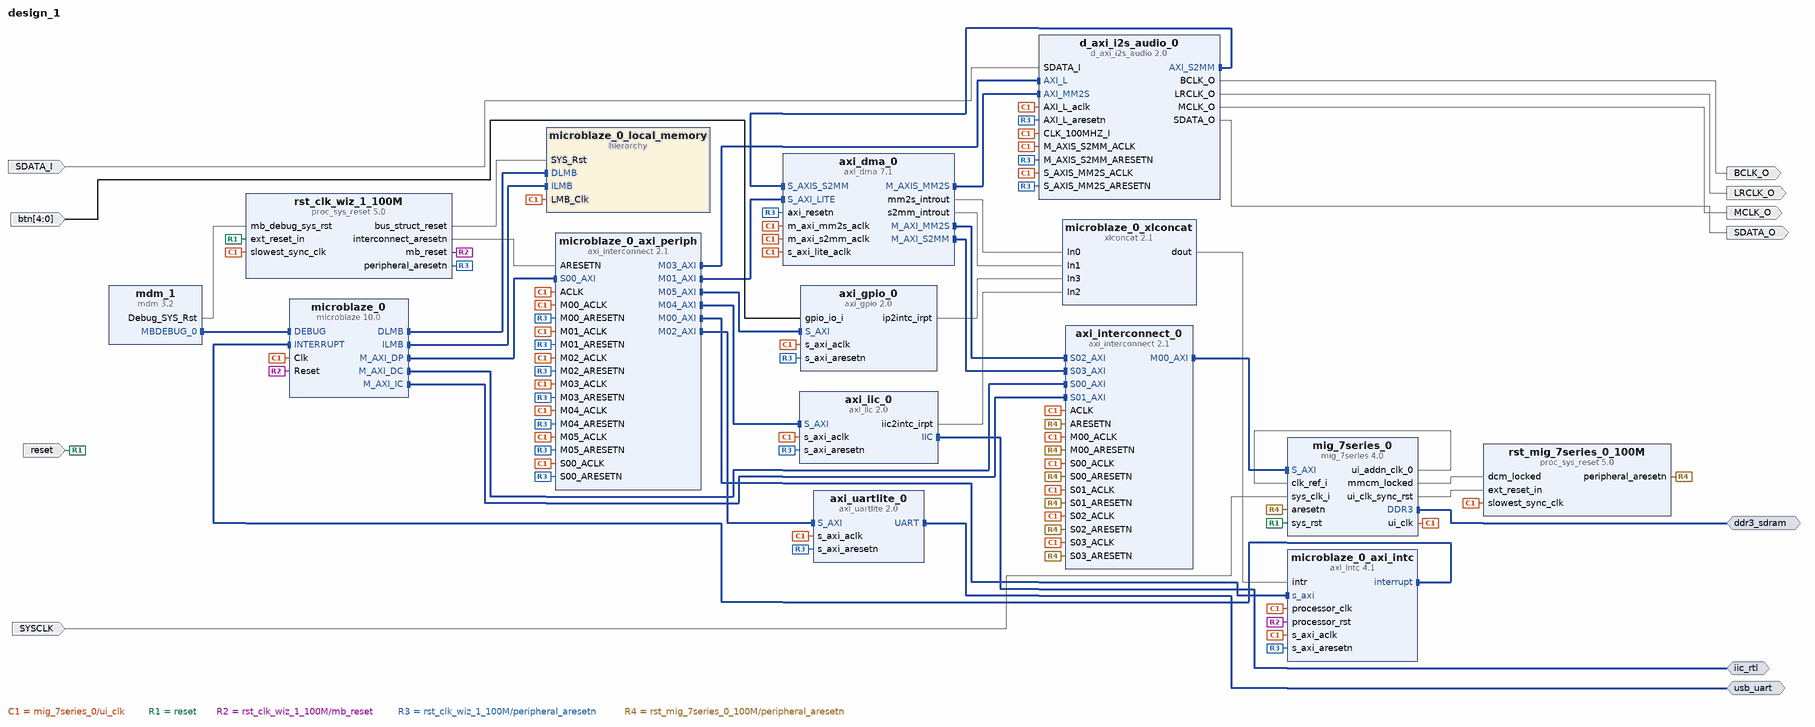
[diagram p0: block diagram of the top level]
# Vivado block design design_1, xc7a200tsbg484-1, Vivado 2016.4
create_bd_design design_1

create_bd_intf_port -mode Master -vlnv xilinx.com:interface:ddrx_rtl:1.0 ddr3_sdram
create_bd_intf_port -mode Master -vlnv xilinx.com:interface:iic_rtl:1.0 iic_rtl
create_bd_intf_port -mode Master -vlnv xilinx.com:interface:uart_rtl:1.0 usb_uart
create_bd_port -dir I SDATA_I
create_bd_port -dir I SYSCLK
create_bd_port -dir I -from 4 -to 0 btn
create_bd_port -dir O BCLK_O
create_bd_port -dir O LRCLK_O
create_bd_port -dir O MCLK_O
create_bd_port -dir O SDATA_O
create_bd_port -dir I -type rst reset
set_property -dict {CONFIG.POLARITY ACTIVE_LOW} [get_bd_ports reset]

create_bd_cell -type hier microblaze_0_local_memory
create_bd_cell -type ip -vlnv xilinx.com:ip:xlconcat:2.1 microblaze_0_xlconcat
set_property -dict {CONFIG.NUM_PORTS 4} [get_bd_cells microblaze_0_xlconcat]
create_bd_cell -type ip -vlnv xilinx.com:ip:axi_dma:7.1 axi_dma_0
set_property -dict [list \
  CONFIG.c_include_sg 0 \
  CONFIG.c_sg_length_width 23 \
  CONFIG.c_include_mm2s_dre 0 \
  CONFIG.c_mm2s_burst_size 256 \
  CONFIG.c_include_s2mm_dre 0 \
  CONFIG.c_s2mm_burst_size 256 \
] [get_bd_cells axi_dma_0]
create_bd_cell -type ip -vlnv xilinx.com:ip:axi_gpio:2.0 axi_gpio_0
set_property -dict [list \
  CONFIG.C_GPIO_WIDTH 5 \
  CONFIG.C_ALL_INPUTS 1 \
  CONFIG.C_INTERRUPT_PRESENT 1 \
  CONFIG.USE_BOARD_FLOW true \
  CONFIG.GPIO_BOARD_INTERFACE Custom \
] [get_bd_cells axi_gpio_0]
create_bd_cell -type ip -vlnv xilinx.com:ip:axi_iic:2.0 axi_iic_0
create_bd_cell -type ip -vlnv xilinx.com:ip:axi_interconnect:2.1 axi_interconnect_0
set_property -dict [list \
  CONFIG.NUM_SI 4 \
  CONFIG.NUM_MI 1 \
  CONFIG.S02_HAS_DATA_FIFO 0 \
  CONFIG.S03_HAS_DATA_FIFO 0 \
] [get_bd_cells axi_interconnect_0]
create_bd_cell -type ip -vlnv xilinx.com:ip:axi_uartlite:2.0 axi_uartlite_0
set_property -dict [list \
  CONFIG.C_BAUDRATE 115200 \
  CONFIG.USE_BOARD_FLOW true \
  CONFIG.UARTLITE_BOARD_INTERFACE usb_uart \
] [get_bd_cells axi_uartlite_0]
create_bd_cell -type ip -vlnv digilentinc.com:user:d_axi_i2s_audio:2.0 d_axi_i2s_audio_0
set_property -dict {CONFIG.ENABLE_STREAM true} [get_bd_cells d_axi_i2s_audio_0]
create_bd_cell -type ip -vlnv xilinx.com:ip:mdm:3.2 mdm_1
create_bd_cell -type ip -vlnv xilinx.com:ip:microblaze:10.0 microblaze_0
set_property -dict [list \
  CONFIG.C_D_AXI 1 \
  CONFIG.C_D_LMB 1 \
  CONFIG.C_I_AXI 0 \
  CONFIG.C_I_LMB 1 \
  CONFIG.C_TRACE 0 \
  CONFIG.C_ENABLE_DISCRETE_PORTS 0 \
  CONFIG.G_TEMPLATE_LIST 6 \
  CONFIG.G_USE_EXCEPTIONS 1 \
  CONFIG.C_USE_MSR_INSTR 1 \
  CONFIG.C_USE_PCMP_INSTR 1 \
  CONFIG.C_USE_BARREL 0 \
  CONFIG.C_USE_DIV 1 \
  CONFIG.C_USE_HW_MUL 1 \
  CONFIG.C_USE_FPU 1 \
  CONFIG.C_M_AXI_D_BUS_EXCEPTION 1 \
  CONFIG.C_DEBUG_ENABLED 1 \
  CONFIG.C_NUMBER_OF_PC_BRK 2 \
  CONFIG.C_USE_ICACHE 1 \
  CONFIG.C_ICACHE_LINE_LEN 8 \
  CONFIG.C_USE_DCACHE 1 \
  CONFIG.C_DCACHE_LINE_LEN 8 \
  CONFIG.C_USE_MMU 0 \
] [get_bd_cells microblaze_0]
create_bd_cell -type ip -vlnv xilinx.com:ip:axi_intc:4.1 microblaze_0_axi_intc
set_property -dict {CONFIG.C_HAS_FAST 1} [get_bd_cells microblaze_0_axi_intc]
create_bd_cell -type ip -vlnv xilinx.com:ip:axi_interconnect:2.1 microblaze_0_axi_periph
set_property -dict {CONFIG.NUM_SI 1 CONFIG.NUM_MI 6} [get_bd_cells microblaze_0_axi_periph]
create_bd_cell -type ip -vlnv xilinx.com:ip:mig_7series:4.0 mig_7series_0
set_property -dict [list \
  CONFIG.XML_INPUT_FILE mig_a.prj \
  CONFIG.RESET_BOARD_INTERFACE reset \
  CONFIG.MIG_DONT_TOUCH_PARAM Custom \
  CONFIG.BOARD_MIG_PARAM ddr3_sdram \
] [get_bd_cells mig_7series_0]
create_bd_cell -type ip -vlnv xilinx.com:ip:proc_sys_reset:5.0 rst_clk_wiz_1_100M
set_property -dict {CONFIG.USE_BOARD_FLOW true CONFIG.RESET_BOARD_INTERFACE reset} [get_bd_cells rst_clk_wiz_1_100M]
create_bd_cell -type ip -vlnv xilinx.com:ip:proc_sys_reset:5.0 rst_mig_7series_0_100M

# ---- hierarchy /microblaze_0_local_memory ----
current_bd_instance /microblaze_0_local_memory
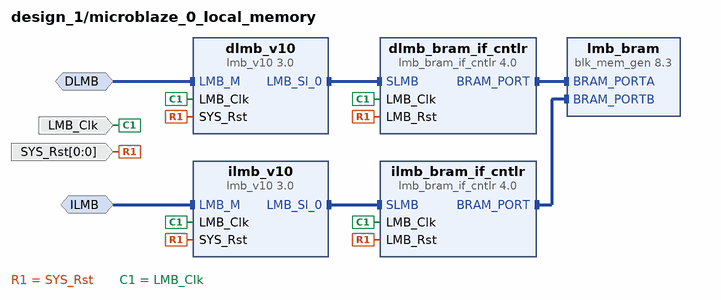
[diagram p1: block diagram inside /microblaze_0_local_memory]
create_bd_intf_pin -mode MirroredMaster -vlnv xilinx.com:interface:lmb_rtl:1.0 DLMB
create_bd_intf_pin -mode MirroredMaster -vlnv xilinx.com:interface:lmb_rtl:1.0 ILMB
create_bd_pin -dir I -type clk LMB_Clk
create_bd_pin -dir I -from 0 -to 0 -type rst SYS_Rst

create_bd_cell -type ip -vlnv xilinx.com:ip:lmb_bram_if_cntlr:4.0 dlmb_bram_if_cntlr
set_property -dict {CONFIG.C_ECC 0} [get_bd_cells dlmb_bram_if_cntlr]
create_bd_cell -type ip -vlnv xilinx.com:ip:lmb_v10:3.0 dlmb_v10
create_bd_cell -type ip -vlnv xilinx.com:ip:lmb_bram_if_cntlr:4.0 ilmb_bram_if_cntlr
set_property -dict {CONFIG.C_ECC 0} [get_bd_cells ilmb_bram_if_cntlr]
create_bd_cell -type ip -vlnv xilinx.com:ip:lmb_v10:3.0 ilmb_v10
create_bd_cell -type ip -vlnv xilinx.com:ip:blk_mem_gen:8.3 lmb_bram
set_property -dict {CONFIG.Memory_Type True_Dual_Port_RAM CONFIG.use_bram_block BRAM_Controller} [get_bd_cells lmb_bram]

# ---- connections ----

current_bd_instance /microblaze_0_local_memory
connect_bd_intf_net -intf_net microblaze_0_dlmb_bus [get_bd_intf_pins dlmb_bram_if_cntlr/SLMB] [get_bd_intf_pins dlmb_v10/LMB_Sl_0]
connect_bd_intf_net -intf_net microblaze_0_dlmb_cntlr [get_bd_intf_pins dlmb_bram_if_cntlr/BRAM_PORT] [get_bd_intf_pins lmb_bram/BRAM_PORTA]
connect_bd_intf_net -intf_net microblaze_0_ilmb_bus [get_bd_intf_pins ilmb_bram_if_cntlr/SLMB] [get_bd_intf_pins ilmb_v10/LMB_Sl_0]
connect_bd_intf_net -intf_net microblaze_0_ilmb_cntlr [get_bd_intf_pins ilmb_bram_if_cntlr/BRAM_PORT] [get_bd_intf_pins lmb_bram/BRAM_PORTB]
connect_bd_intf_net -intf_net microblaze_0_dlmb [get_bd_intf_pins DLMB] [get_bd_intf_pins dlmb_v10/LMB_M]
connect_bd_intf_net -intf_net microblaze_0_ilmb [get_bd_intf_pins ILMB] [get_bd_intf_pins ilmb_v10/LMB_M]
connect_bd_net [get_bd_pins SYS_Rst] \
  [get_bd_pins dlmb_bram_if_cntlr/LMB_Rst] [get_bd_pins dlmb_v10/SYS_Rst] [get_bd_pins ilmb_bram_if_cntlr/LMB_Rst] \
  [get_bd_pins ilmb_v10/SYS_Rst]
connect_bd_net -net microblaze_0_Clk [get_bd_pins LMB_Clk] \
  [get_bd_pins dlmb_bram_if_cntlr/LMB_Clk] [get_bd_pins dlmb_v10/LMB_Clk] [get_bd_pins ilmb_bram_if_cntlr/LMB_Clk] \
  [get_bd_pins ilmb_v10/LMB_Clk]

current_bd_instance /
connect_bd_intf_net [get_bd_intf_pins axi_dma_0/M_AXIS_MM2S] [get_bd_intf_pins d_axi_i2s_audio_0/AXI_MM2S]
connect_bd_intf_net [get_bd_intf_pins axi_dma_0/M_AXI_MM2S] [get_bd_intf_pins axi_interconnect_0/S02_AXI]
connect_bd_intf_net [get_bd_intf_pins axi_dma_0/M_AXI_S2MM] [get_bd_intf_pins axi_interconnect_0/S03_AXI]
connect_bd_intf_net [get_bd_intf_pins axi_interconnect_0/M00_AXI] [get_bd_intf_pins mig_7series_0/S_AXI]
connect_bd_intf_net [get_bd_intf_pins axi_dma_0/S_AXIS_S2MM] [get_bd_intf_pins d_axi_i2s_audio_0/AXI_S2MM]
connect_bd_intf_net [get_bd_intf_pins axi_interconnect_0/S00_AXI] [get_bd_intf_pins microblaze_0/M_AXI_DC]
connect_bd_intf_net [get_bd_intf_pins axi_interconnect_0/S01_AXI] [get_bd_intf_pins microblaze_0/M_AXI_IC]
connect_bd_intf_net -intf_net microblaze_0_axi_dp [get_bd_intf_pins microblaze_0/M_AXI_DP] [get_bd_intf_pins microblaze_0_axi_periph/S00_AXI]
connect_bd_intf_net [get_bd_intf_pins axi_dma_0/S_AXI_LITE] [get_bd_intf_pins microblaze_0_axi_periph/M01_AXI]
connect_bd_intf_net [get_bd_intf_pins axi_uartlite_0/S_AXI] [get_bd_intf_pins microblaze_0_axi_periph/M02_AXI]
connect_bd_intf_net [get_bd_intf_pins d_axi_i2s_audio_0/AXI_L] [get_bd_intf_pins microblaze_0_axi_periph/M03_AXI]
connect_bd_intf_net [get_bd_intf_pins axi_iic_0/S_AXI] [get_bd_intf_pins microblaze_0_axi_periph/M04_AXI]
connect_bd_intf_net [get_bd_intf_pins axi_gpio_0/S_AXI] [get_bd_intf_pins microblaze_0_axi_periph/M05_AXI]
connect_bd_intf_net [get_bd_intf_pins mdm_1/MBDEBUG_0] [get_bd_intf_pins microblaze_0/DEBUG]
connect_bd_intf_net [get_bd_intf_pins microblaze_0/DLMB] [get_bd_intf_pins microblaze_0_local_memory/DLMB]
connect_bd_intf_net [get_bd_intf_pins microblaze_0/ILMB] [get_bd_intf_pins microblaze_0_local_memory/ILMB]
connect_bd_intf_net -intf_net microblaze_0_intc_axi [get_bd_intf_pins microblaze_0_axi_intc/s_axi] [get_bd_intf_pins microblaze_0_axi_periph/M00_AXI]
connect_bd_intf_net [get_bd_intf_pins microblaze_0/INTERRUPT] [get_bd_intf_pins microblaze_0_axi_intc/interrupt]
connect_bd_intf_net [get_bd_intf_ports ddr3_sdram] [get_bd_intf_pins mig_7series_0/DDR3]
connect_bd_intf_net [get_bd_intf_ports iic_rtl] [get_bd_intf_pins axi_iic_0/IIC]
connect_bd_intf_net [get_bd_intf_ports usb_uart] [get_bd_intf_pins axi_uartlite_0/UART]
connect_bd_net [get_bd_ports SDATA_I] [get_bd_pins d_axi_i2s_audio_0/SDATA_I]
connect_bd_net [get_bd_ports SYSCLK] [get_bd_pins mig_7series_0/sys_clk_i]
connect_bd_net [get_bd_pins axi_dma_0/mm2s_introut] [get_bd_pins microblaze_0_xlconcat/In0]
connect_bd_net [get_bd_pins axi_dma_0/s2mm_introut] [get_bd_pins microblaze_0_xlconcat/In1]
connect_bd_net [get_bd_pins axi_gpio_0/ip2intc_irpt] [get_bd_pins microblaze_0_xlconcat/In3]
connect_bd_net [get_bd_pins axi_iic_0/iic2intc_irpt] [get_bd_pins microblaze_0_xlconcat/In2]
connect_bd_net [get_bd_ports btn] [get_bd_pins axi_gpio_0/gpio_io_i]
connect_bd_net [get_bd_pins d_axi_i2s_audio_0/BCLK_O] [get_bd_ports BCLK_O]
connect_bd_net [get_bd_pins d_axi_i2s_audio_0/LRCLK_O] [get_bd_ports LRCLK_O]
connect_bd_net [get_bd_pins d_axi_i2s_audio_0/MCLK_O] [get_bd_ports MCLK_O]
connect_bd_net [get_bd_pins d_axi_i2s_audio_0/SDATA_O] [get_bd_ports SDATA_O]
connect_bd_net [get_bd_pins mdm_1/Debug_SYS_Rst] [get_bd_pins rst_clk_wiz_1_100M/mb_debug_sys_rst]
connect_bd_net -net microblaze_0_intr [get_bd_pins microblaze_0_xlconcat/dout] [get_bd_pins microblaze_0_axi_intc/intr]
connect_bd_net [get_bd_pins mig_7series_0/mmcm_locked] [get_bd_pins rst_mig_7series_0_100M/dcm_locked]
connect_bd_net [get_bd_pins mig_7series_0/ui_addn_clk_0] [get_bd_pins mig_7series_0/clk_ref_i]
connect_bd_net [get_bd_pins mig_7series_0/ui_clk] \
  [get_bd_pins microblaze_0_local_memory/LMB_Clk] [get_bd_pins axi_dma_0/s_axi_lite_aclk] \
  [get_bd_pins axi_dma_0/m_axi_mm2s_aclk] [get_bd_pins axi_dma_0/m_axi_s2mm_aclk] [get_bd_pins axi_gpio_0/s_axi_aclk] \
  [get_bd_pins axi_iic_0/s_axi_aclk] [get_bd_pins axi_interconnect_0/ACLK] [get_bd_pins axi_interconnect_0/S00_ACLK] \
  [get_bd_pins axi_interconnect_0/M00_ACLK] [get_bd_pins axi_interconnect_0/S01_ACLK] \
  [get_bd_pins axi_interconnect_0/S02_ACLK] [get_bd_pins axi_interconnect_0/S03_ACLK] [get_bd_pins axi_uartlite_0/s_axi_aclk] \
  [get_bd_pins d_axi_i2s_audio_0/CLK_100MHZ_I] [get_bd_pins d_axi_i2s_audio_0/S_AXIS_MM2S_ACLK] \
  [get_bd_pins d_axi_i2s_audio_0/M_AXIS_S2MM_ACLK] [get_bd_pins d_axi_i2s_audio_0/AXI_L_aclk] [get_bd_pins microblaze_0/Clk] \
  [get_bd_pins microblaze_0_axi_intc/s_axi_aclk] [get_bd_pins microblaze_0_axi_intc/processor_clk] \
  [get_bd_pins microblaze_0_axi_periph/ACLK] [get_bd_pins microblaze_0_axi_periph/S00_ACLK] \
  [get_bd_pins microblaze_0_axi_periph/M00_ACLK] [get_bd_pins microblaze_0_axi_periph/M01_ACLK] \
  [get_bd_pins microblaze_0_axi_periph/M02_ACLK] [get_bd_pins microblaze_0_axi_periph/M03_ACLK] \
  [get_bd_pins microblaze_0_axi_periph/M04_ACLK] [get_bd_pins microblaze_0_axi_periph/M05_ACLK] \
  [get_bd_pins rst_clk_wiz_1_100M/slowest_sync_clk] [get_bd_pins rst_mig_7series_0_100M/slowest_sync_clk]
connect_bd_net [get_bd_pins mig_7series_0/ui_clk_sync_rst] [get_bd_pins rst_mig_7series_0_100M/ext_reset_in]
connect_bd_net [get_bd_ports reset] [get_bd_pins mig_7series_0/sys_rst] [get_bd_pins rst_clk_wiz_1_100M/ext_reset_in]
connect_bd_net [get_bd_pins rst_clk_wiz_1_100M/bus_struct_reset] [get_bd_pins microblaze_0_local_memory/SYS_Rst]
connect_bd_net [get_bd_pins rst_clk_wiz_1_100M/interconnect_aresetn] [get_bd_pins microblaze_0_axi_periph/ARESETN]
connect_bd_net [get_bd_pins rst_clk_wiz_1_100M/mb_reset] [get_bd_pins microblaze_0/Reset] [get_bd_pins microblaze_0_axi_intc/processor_rst]
connect_bd_net [get_bd_pins rst_clk_wiz_1_100M/peripheral_aresetn] \
  [get_bd_pins axi_dma_0/axi_resetn] [get_bd_pins axi_gpio_0/s_axi_aresetn] [get_bd_pins axi_iic_0/s_axi_aresetn] \
  [get_bd_pins axi_uartlite_0/s_axi_aresetn] [get_bd_pins d_axi_i2s_audio_0/S_AXIS_MM2S_ARESETN] \
  [get_bd_pins d_axi_i2s_audio_0/M_AXIS_S2MM_ARESETN] [get_bd_pins d_axi_i2s_audio_0/AXI_L_aresetn] \
  [get_bd_pins microblaze_0_axi_intc/s_axi_aresetn] [get_bd_pins microblaze_0_axi_periph/S00_ARESETN] \
  [get_bd_pins microblaze_0_axi_periph/M00_ARESETN] [get_bd_pins microblaze_0_axi_periph/M01_ARESETN] \
  [get_bd_pins microblaze_0_axi_periph/M02_ARESETN] [get_bd_pins microblaze_0_axi_periph/M03_ARESETN] \
  [get_bd_pins microblaze_0_axi_periph/M04_ARESETN] [get_bd_pins microblaze_0_axi_periph/M05_ARESETN]
connect_bd_net [get_bd_pins rst_mig_7series_0_100M/peripheral_aresetn] \
  [get_bd_pins axi_interconnect_0/ARESETN] [get_bd_pins axi_interconnect_0/S00_ARESETN] \
  [get_bd_pins axi_interconnect_0/M00_ARESETN] [get_bd_pins axi_interconnect_0/S01_ARESETN] \
  [get_bd_pins axi_interconnect_0/S02_ARESETN] [get_bd_pins axi_interconnect_0/S03_ARESETN] \
  [get_bd_pins mig_7series_0/aresetn]

# ---- address map ----
assign_bd_address -offset 0x80000000 -range 512M -target_address_space [get_bd_addr_spaces axi_dma_0/Data_MM2S] [get_bd_addr_segs mig_7series_0/memmap/memaddr]
assign_bd_address -offset 0x80000000 -range 512M -target_address_space [get_bd_addr_spaces axi_dma_0/Data_S2MM] [get_bd_addr_segs mig_7series_0/memmap/memaddr]
assign_bd_address -offset 0x00000000 -range 8K -target_address_space [get_bd_addr_spaces microblaze_0/Data] [get_bd_addr_segs microblaze_0_local_memory/dlmb_bram_if_cntlr/SLMB/Mem]
assign_bd_address -offset 0x40000000 -range 64K -target_address_space [get_bd_addr_spaces microblaze_0/Data] [get_bd_addr_segs axi_gpio_0/S_AXI/Reg]
assign_bd_address -offset 0x40600000 -range 64K -target_address_space [get_bd_addr_spaces microblaze_0/Data] [get_bd_addr_segs axi_uartlite_0/S_AXI/Reg]
assign_bd_address -offset 0x40800000 -range 64K -target_address_space [get_bd_addr_spaces microblaze_0/Data] [get_bd_addr_segs axi_iic_0/S_AXI/Reg]
assign_bd_address -offset 0x41200000 -range 64K -target_address_space [get_bd_addr_spaces microblaze_0/Data] [get_bd_addr_segs microblaze_0_axi_intc/S_AXI/Reg]
assign_bd_address -offset 0x41E00000 -range 64K -target_address_space [get_bd_addr_spaces microblaze_0/Data] [get_bd_addr_segs axi_dma_0/S_AXI_LITE/Reg]
assign_bd_address -offset 0x44A00000 -range 64K -target_address_space [get_bd_addr_spaces microblaze_0/Data] [get_bd_addr_segs d_axi_i2s_audio_0/AXI_L/AXI_L_reg]
assign_bd_address -offset 0x80000000 -range 512M -target_address_space [get_bd_addr_spaces microblaze_0/Data] [get_bd_addr_segs mig_7series_0/memmap/memaddr]
assign_bd_address -offset 0x00000000 -range 8K -target_address_space [get_bd_addr_spaces microblaze_0/Instruction] [get_bd_addr_segs microblaze_0_local_memory/ilmb_bram_if_cntlr/SLMB/Mem]
assign_bd_address -offset 0x80000000 -range 512M -target_address_space [get_bd_addr_spaces microblaze_0/Instruction] [get_bd_addr_segs mig_7series_0/memmap/memaddr]

validate_bd_design
save_bd_design
